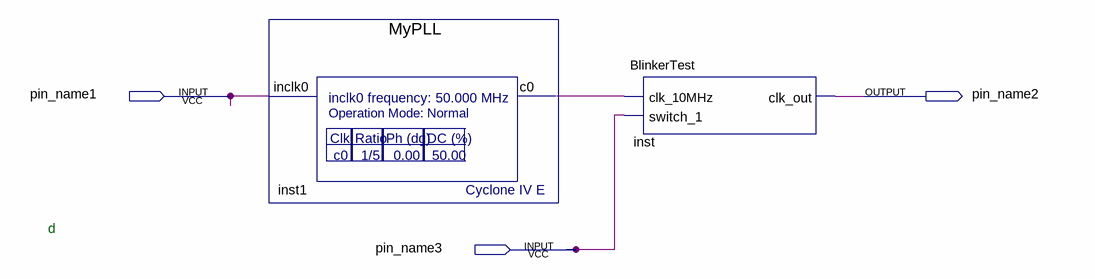
[diagram p0: schematic sheet]
// Quartus schematic BlinkerTest_TopLevel.bdf as structural Verilog: 2 symbols, 3 pins
module BlinkerTest_TopLevel (
  input  pin_name1,
  input  pin_name3,
  output pin_name2
);

  wire inst1_c0;

  MyPLL inst1 (.inclk0(pin_name1), .c0(inst1_c0));
  BlinkerTest inst (.clk_10MHz(inst1_c0), .switch_1(pin_name3), .clk_out(pin_name2));

  // Notes on the sheet:
  //   d
endmodule
